# EAGLE design usb-lux-meter-v1 (EAGLE 6.5.0)
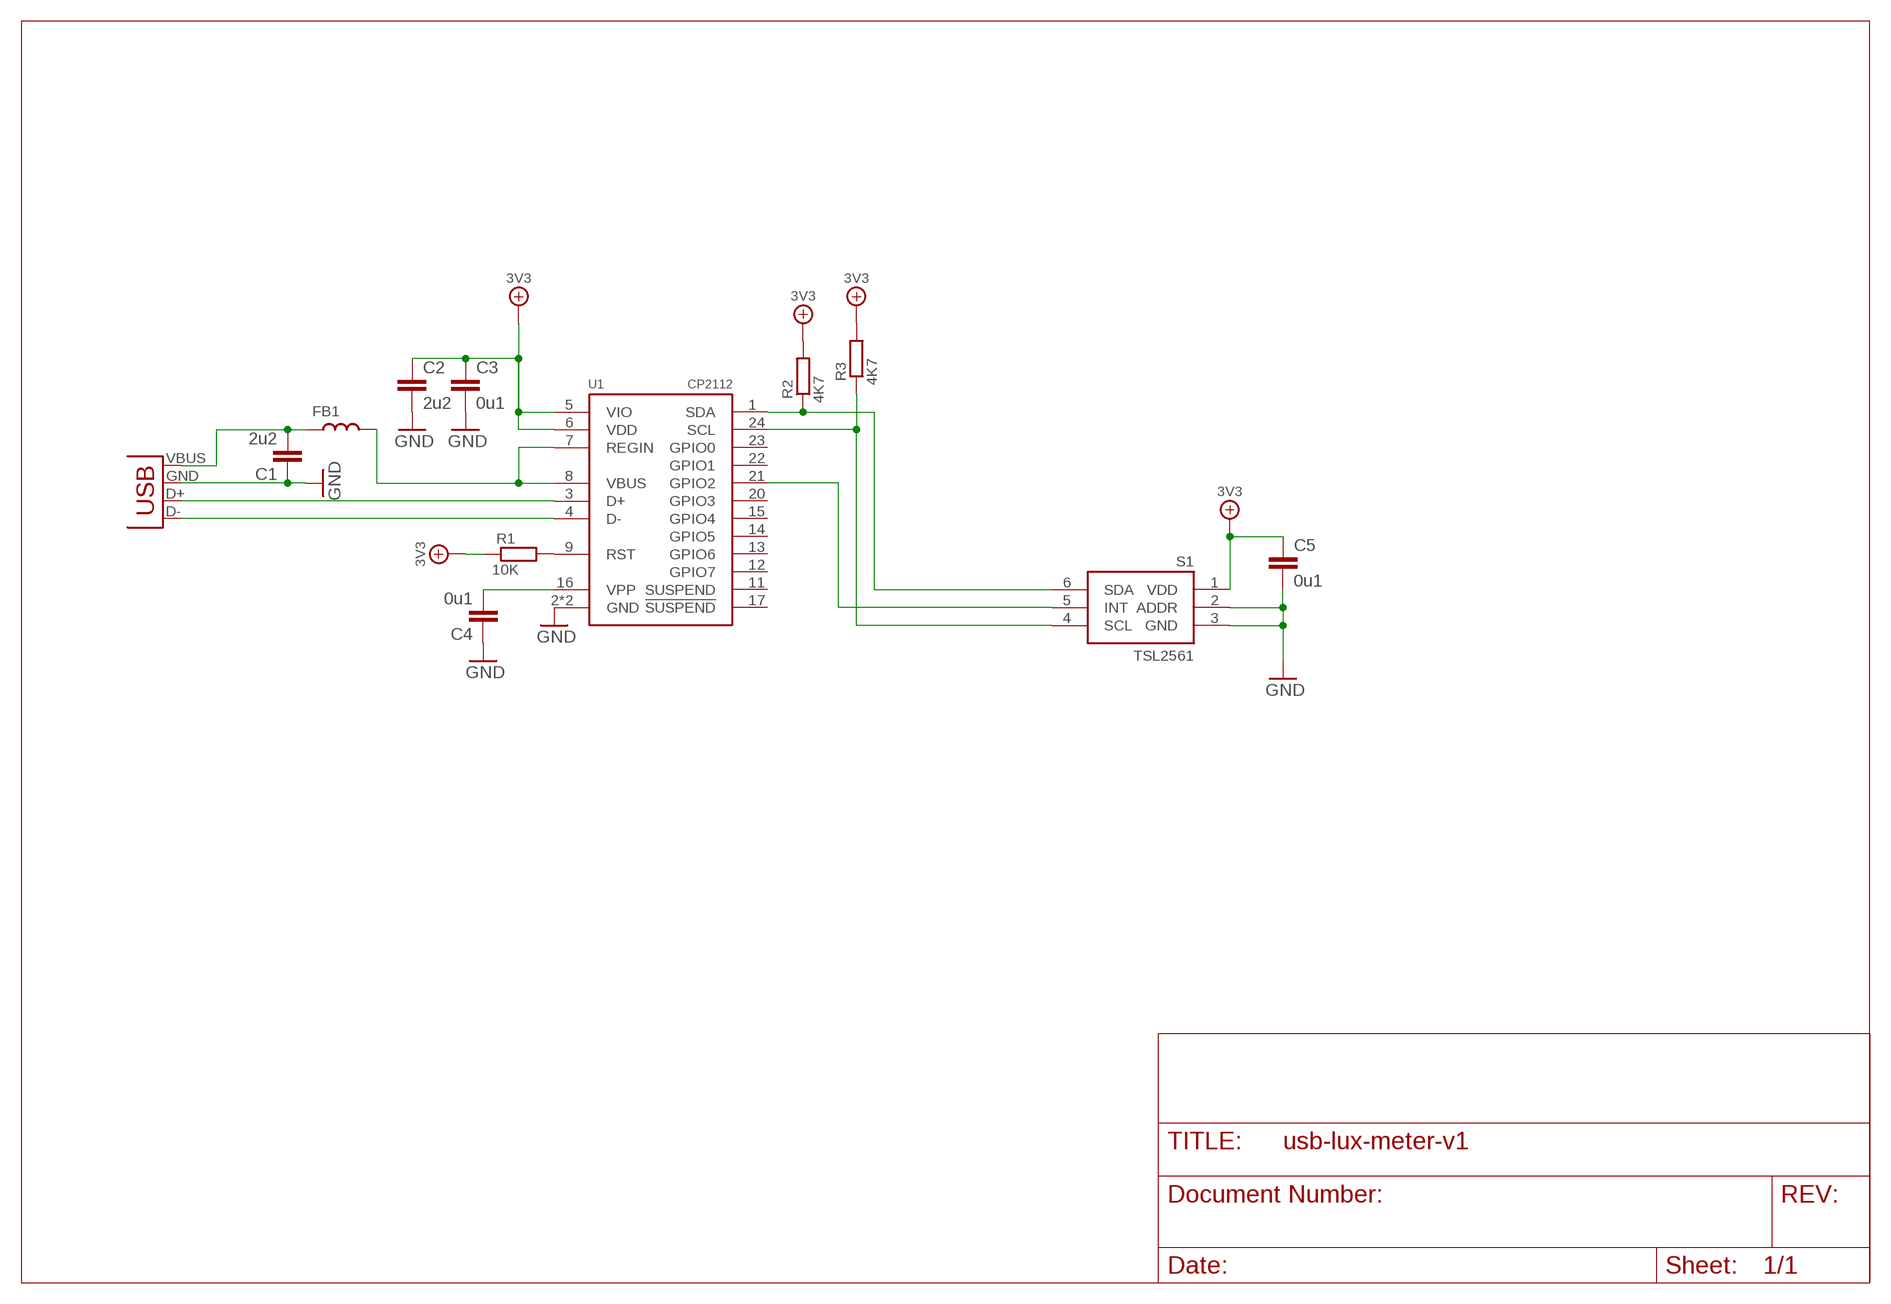
[diagram p0: schematic, sheet 1]

## Parts
C1  2u2  CC0603  [C0603]
C2  2u2  CC0603  [C0603]
C3  0u1  CC0603  [C0603]
C4  0u1  CC0603  [C0603]
C5  0u1  CC0603  [C0603]
CN1  USB-A-H  [USB-A-H]
FB1  L0603  [R603]
R1  10K  RR603  [R603]
R2  4K7  RR603  [R603]
R3  4K7  RR603  [R603]
S1  TSL2561  [TSL2561]
U1  CP2112  [QFN24]

## Nets
3V3: C2.1 C3.1 C5.1 R1.1 R2.2 R3.2 S1.1(VDD) U1.5(VIO) U1.6(VDD)
CN1: CN1.D+(D-) U1.3(D+)
GND: C1.1 C2.2 C3.2 C4.1 C5.2 CN1.GND(VBUS) S1.2(ADDR) S1.3(GND) U1.2(GND) U1.GND
N$1: S1.5(INT) U1.21(GPIO2)
N$2: R1.2 U1.9(RST)
N$4: C4.2 U1.16(VPP)
N$5: R3.1 S1.4(SCL) U1.24(SCL)
N$6: C1.2 CN1.VBUS(GND) FB1.1
N$10: R2.1 S1.6(SDA) U1.1(SDA)
N$12: CN1.D-(D+) U1.4(D-)
VBUS: FB1.2 U1.7(REGIN) U1.8(VBUS)
Unconnected: U1.11(SUSPEND) U1.12(GPIO7) U1.13(GPIO6) U1.14(GPIO5) U1.15(GPIO4) U1.17(!SUSPEND) U1.20(GPIO3) U1.22(GPIO1) U1.23(GPIO0)

## Library data of the parts
C1-C5 = discrete:C: CAPACITOR, European symbol
CN1 = connectors:USB: USB Connectors USB-B-PTH is fully proven SKU : PRT-00139 USB-miniB is fully proven SKU : PRT-00587 USB-A-PCB is untested. USB-A-H is throughly reviewed, but untested. Spark Fun Electronics SKU : PRT-00437 USB-B-SMT is throughly reviewed, but untested. Needs silkscreen touching up. USB-A-S has not been used/tested USB-MB-H has not been used/tested
FB1 = discrete:L
R1-R3 = discrete:R
S1 = sensor:TSL2561
U1 = ic:CP2112

## Net classes
0 default: width 0.152 mm, drill 0.305 mm, clearance 0.152 mm
1 RF: width 0.152 mm, clearance 0.152 mm

## Board
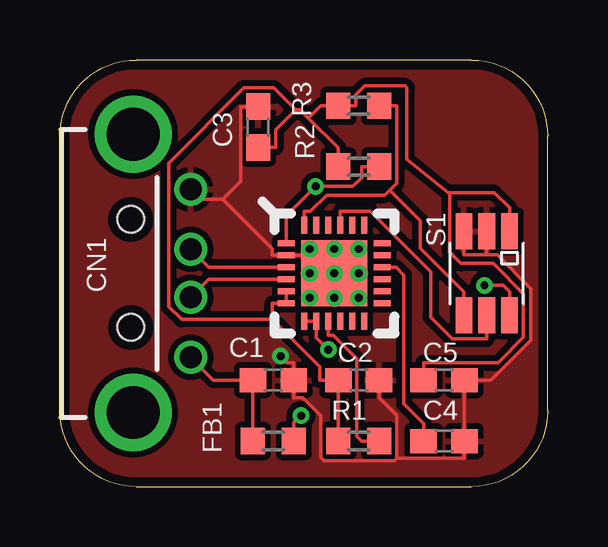
[diagram p1: board, top side]
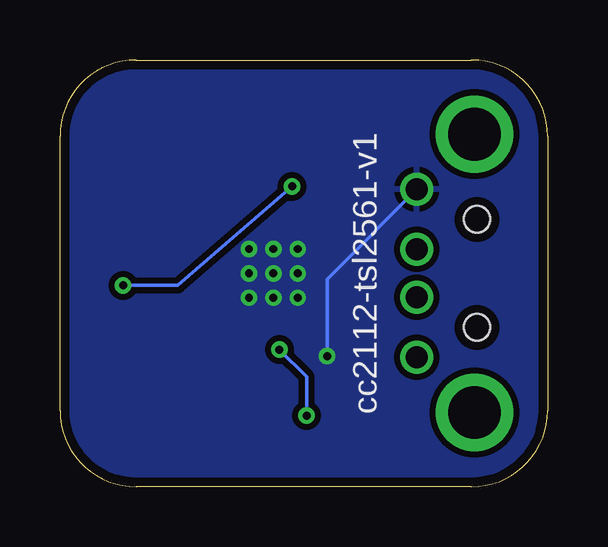
[diagram p2: board, bottom side, seen from below]

Size 20.32 x 17.78 mm. Coordinates in mm from the lower left corner, seen from the top.
Outline: 3.17,0 17.14,0 arc90 20.32,3.17 20.32,14.61 arc90 17.14,17.78 3.17,17.78 arc90 0,14.61 0,3.17 arc90 3.17,0
Copper layers (1*16): Top 0.0356mm / dielectric 1.5011mm / Bottom 0.0356mm
Design rules "LaenPCBOrder": minimum track width 6mil, minimum drill 13mil, track to track 6mil, track to pad 6mil, pad to pad 6mil, via to via 6mil, smd to smd 6mil, copper to edge 15mil, drill to drill 6mil, minimum pad ring 7mil, minimum via ring 7mil, stop-mask expansion 4mil, vias tented up to drill 0mil, thermal gap 10mil

### Footprints (pad centres in the part's own frame; a part is rotated, then mirrored left to right if it is on the bottom)
C0603 = smd 1.1 x 1: 1 -0.85,0; 2 0.85,0
USB-A-H = drill 0.914: D+ 2.4,1; D- 2.4,-1; GND 2.4,3.5; VBUS 2.4,-3.5 | drill 2.2: GND@1 0,5.8; GND@2 0,-5.8 | hole 1.1: -0.1,2.25; -0.1,-2.25
R603 = smd 1 x 1.1: 1 -0.85,0; 2 0.85,0
TSL2561 = smd 1.5 x 0.7: 1 -1.75,0.95; 2 -1.75,0; 3 -1.75,-0.95; 4 1.75,-0.95; 5 1.75,0; 6 1.75,0.95
QFN24 = smd 0.7 x 0.25: 1 -2,1.25; 2 -2,0.75; 3 -2,0.25; 4 -2,-0.25; 5 -2,-0.75; 6 -2,-1.25; 13 2,-1.25; 14 2,-0.75; 15 2,-0.25; 16 2,0.25; 17 2,0.75; 18 2,1.25 | smd 0.25 x 0.7: 7 -1.25,-2; 8 -0.75,-2; 9 -0.25,-2; 10 0.25,-2; 11 0.75,-2; 12 1.25,-2; 19 1.25,2; 20 0.75,2; 21 0.25,2; 22 -0.25,2; 23 -0.75,2; 24 -1.25,2 | smd 2.75 x 2.75: GND 0,0

### Placement (x,y rotation side)
C1  8.89,4.45 180 top
C2  12.45,4.45 0 top
C3  8.26,14.99 90 top
C4  16,1.91 180 top
C5  16,4.45 0 top
CN1  3.05,8.89 0 top
FB1  8.89,1.91 0 top
R1  12.45,1.91 0 top
R2  12.45,13.34 180 top
R3  12.45,15.88 180 top
S1  17.78,8.89 270 top
U1  11.43,8.89 0 top

### Tracks (layer width: path | path; a pad name or v marks a point on that pad's centre or on a via)
3V3
  Top 0.152: 16.18,12.26 | 16.18,12.26 14.45,13.63 14.45,16.63 14.38,16.7 12.7,16.7 12.32,16.33 12.32,15.88 R3.2 10.87,15.88 10.35,15.36 | 10.35,15.36 10.01,15.7 9.82,15.7 | 10.35,15.36 11.6,14.11 R2.2 | C3.1 8.98,14.14 8.98,14.87 9.82,15.7 | 8.85,6.97 5.06,6.97 4.53,7.51 4.53,13.49 7.66,16.61 8.9,16.61 9.82,15.7 | 16.24,12.26 16.24,11.49 16.24,9.77 16.7,9.31 18.05,9.31 19.31,8.04 19.31,6.23 18.25,5.17 15.15,5.17 C5.1 | 8.85,6.97 10.82,5.01 10.82,4.45 C2.1 R1.1 | 8.85,6.97 8.85,7.64 U1.6 U1.5 | 16.24,12.26 18.09,12.26 18.73,11.62 S1.1 | 16.24,12.26 16.18,12.26
CN1
  Top 0.152: U1.3 6.2,9.14 CN1.D+
GND  (via drill 0.33 pad 0.69)
  Top 0.152: v9.19,5.44 9.46,5.17 9.74,5.17 C1.1 9.74,3.72 10.1,3.72 10.87,2.95 10.87,1.23 11.01,1.09 13.94,1.09 14.03,1.18 | 14.03,1.18 14.03,2.99 13.3,3.72 C2.2 | 14.03,1.18 16.85,1.18 C4.1 16.85,4.06 17.24,4.45 | 6.78,11.98 7.53,12.73 7.53,15.84 C3.2 | CN1.GND 5.86,11.98 6.78,11.98 | 6.78,11.98 8.85,9.91 8.85,9.64 U1.2 10.68,9.64 U1.GND | 17.78,9.66 18.21,9.66 19.61,8.26 19.61,6.1 17.95,4.45 17.63,4.45 17.24,4.45 | C5.2 17.24,4.45 | 17.78,9.66 17.78,9.74 S1.2 | S1.3 16.83,9.66 17.78,9.66
  Bottom 0.152: CN1.GND 9.19,8.65 v9.19,5.44
  other vias: 11.43,8.89 10.41,8.89 10.41,9.91 11.43,9.91 12.45,9.91 12.45,8.89 12.45,7.87 11.43,7.87 10.41,7.87
  pour Top (isolate 0.254): 3.17,17.78 arc90 0,14.61 0,3.17 arc90 3.17,0 17.14,0 arc90 20.32,3.17 20.32,14.61 arc90 17.14,17.78
  pour Bottom (isolate 0.254): 3.17,17.78 arc90 0,14.61 0,3.17 arc90 3.17,0 17.14,0 arc90 20.32,3.17 20.32,14.61 arc90 17.14,17.78
N$1
  Top 0.152: S1.5 17.78,6.16 16.35,6.16 15.45,7.07 15.45,8.95 12.92,11.47 11.68,11.47 U1.21
N$2
  Top 0.152: R1.2 12.57,1.91 12.38,2.1 12.38,5.33 11.39,6.31 11.18,6.31 U1.9
N$4
  Top 0.152: C4.2 15.15,2.63 14.33,3.45 14.33,8.82 14.01,9.14 U1.16
N$5
  Top 0.152: S1.4 16.83,8.12 15.02,9.93 15.02,11.09 13.74,12.36 | 13.74,12.36 14.03,12.64 14.03,15.88 R3.1 | 13.74,12.36 13.53,12.15 11.11,12.15 10.43,11.47 10.18,11.47 U1.24
N$6
  Top 0.152: CN1.VBUS 6.39,4.45 C1.2 FB1.1
N$10  (via drill 0.33 pad 0.69)
  Top 0.152: U1.1 9.43,11.29 v10.65,12.51 12.2,12.51 12.57,12.88 12.57,13.34 R2.1 | S1.6 18.73,8.12 18.46,8.39 v17.69,8.39
  Bottom 0.152: v17.69,8.39 15.41,8.39 v10.65,12.51
N$12
  Top 0.152: U1.4 6.2,8.64 CN1.D-
VBUS  (via drill 0.33 pad 0.69)
  Top 0.152: v11.18,5.71 10.68,6.21 U1.8 U1.7 | v10.04,2.96 9.77,2.68 9.74,2.68 FB1.2
  Bottom 0.152: v10.04,2.96 10.04,4.58 v11.18,5.71

### Text on the board
bNames: cc2112-tsl2561-v1